# EAGLE design usb2 (EAGLE 9.0.1)
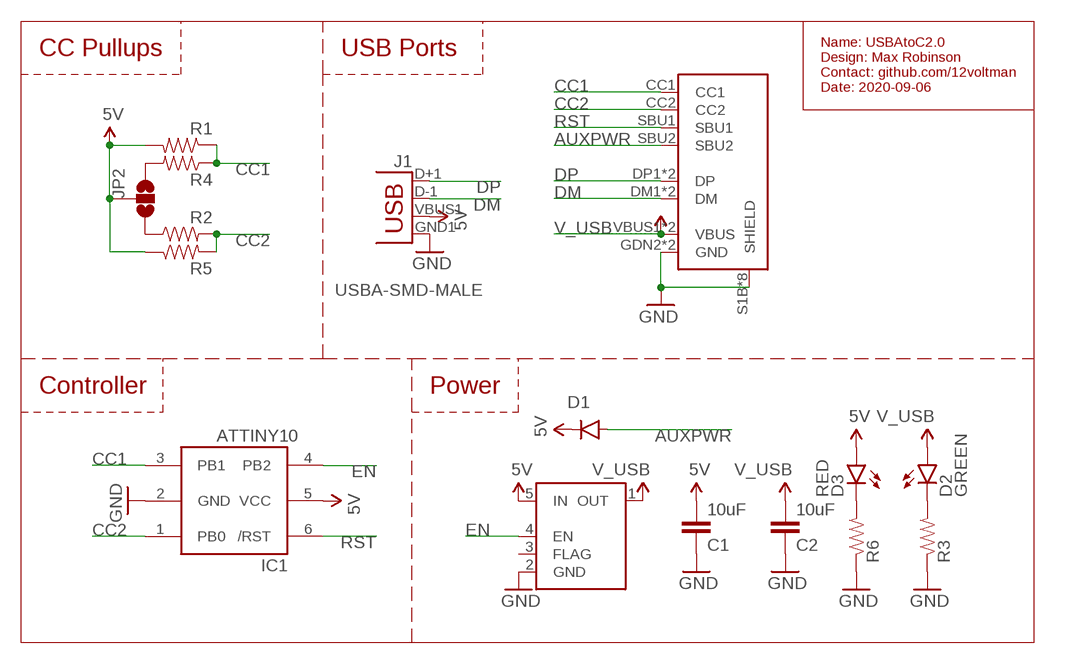
[diagram p0: schematic, sheet 1]

## Parts
C1  10uF  10UF-6.3V-20%(0603)  [0603-CAP]
C2  10uF  10UF-6.3V-20%(0603)  [0603-CAP]
D1  250mA/100V  DIODEBAS16  [SOD-323]
D2  GREEN  LED-GREEN0603  [LED-0603]
D3  RED  LED-RED0603  [LED-0603]
IC1  ATTINY10  [SOT23-6]
J1  USBA-SMD-MALE  [USB-A-SMT-MALE]
JP2  JUMPER-PAD-3-NOYES_SILK  [PAD-JUMPER-3-NO_YES_SILK]
R1  RESISTOR0603  [0603-RES]
R2  RESISTOR0603  [0603-RES]
R3  RESISTOR0603  [0603-RES]
R4  RESISTOR0603  [0603-RES]
R5  RESISTOR0603  [0603-RES]
R6  RESISTOR0603  [0603-RES]
U$1  USB-C_USB2ONLY-OUTLINE  [USB-C_12PIN_HORZ-F-OUTLINE]
U$2  AP22804/14*W5-7  [SOT23-5]

## Nets
5V: C1.2 D1.C D3.A IC1.5(VCC) J1.VBUS1(VBUS) JP2.2 R1.2 R5.1 U$2.5(IN)
AUXPWR: D1.A U$1.SBU2
CC1: IC1.3(PB1) R1.1 R4.1 U$1.CC1
CC2: IC1.1(PB0) R2.2 R5.2 U$1.CC2
DM: J1.D-1(D-) U$1.DM1(DM) U$1.DM2(DM)
DP: J1.D+1(D+) U$1.DP1(DP) U$1.DP2(DP)
EN: IC1.4(PB2) U$2.4(EN)
GND: C1.1 C2.1 IC1.2(GND) J1.GND1(GND) R3.1 R6.1 U$1.GDN2(GND) U$1.GND1(GND) U$1.S1B(SHIELD) U$1.S1T(SHIELD) U$1.S2B(SHIELD) U$1.S2T(SHIELD) U$1.S3B(SHIELD) U$1.S3T(SHIELD) U$1.S4B(SHIELD) U$1.S4T(SHIELD) U$2.2(GND)
N$1: D2.C R3.2
N$2: JP2.3 R2.1
N$3: JP2.1 R4.2
N$4: D3.C R6.2
RST: IC1.6(/RST) U$1.SBU1
V_USB: C2.2 D2.A U$1.VBUS1(VBUS) U$1.VBUS2(VBUS) U$2.1(OUT)
Unconnected: U$2.3(FLAG)

## Notes on the sheet
- CC Pullups | USB Ports
- Name: USBAtoC2.0
  Design: Max Robinson
  Contact: github.com/12voltman
  Date: 2020-09-06
- Controller | Power

## Library data of the parts
C1 C2 = SparkFun-Capacitors:10UF-6.3V-20%(0603): CAP-11015; PROD_ID: CAP-11015
D1 = SparkFun-DiscreteSemi:DIODE: Diode These are standard reverse protection diodes and small signal diodes. SMA package can handle up to about 1A. SOD-323 can handle about 200mA. What the SOD-323 package when ordering, there are some mfgs out there that are 5-pin packages.; PROD_ID: DIO-09646
D2 = SparkFun-LED:LED-GREEN: Various green LEDs Green LEDs used in SFE Production 0603- DIO-00821 LARGE- DIO-00862 LILYPAD- DIO-09910; PROD_ID: DIO-00821
D3 = SparkFun-LED:LED-RED: Assorted Red LEDs LilyPad 1206- DIO-09912 1206- DIO-00809 0603- DIO-00819 "SMART" means more efficient and expensive; PROD_ID: DIO-00819
IC1 = adafruit:ATTINY10: ATtiny4/5/9/10 8-bit Microcontroller with 512/1024 Bytes In-System Programmable Flash
J1 = SparkFun-Connectors:USB: USB Connectors USB-B-PTH is fully proven SKU : PRT-00139/CONN-08278 USB-miniB is fully proven SKU : PRT-00587 USB-A-PCB is untested. USB-A-H is throughly reviewed, but untested. Spark Fun Electronics SKU : PRT-00437 USB-B-SMT is throughly reviewed, but untested. Needs silkscreen touching up. USB-A-S has not been used/tested USB-MB-H has not been used/tested USB-MICROB has been used. CONN-09505
JP2 = SparkFun-Passives:JUMPER-PAD-3-NO
R1-R6 = SparkFun-Resistors:RESISTOR: Resistor Basic schematic elements and footprints for 0603, 1206, and PTH resistors.
U$1 = 12voltman:USB-C_USB2ONLY
U$2 = 12voltman:AP22804/14: AP22804 / AP22814 Single-channel load switch with current limiting. Ideal for USB host power control. Tech specs: Current Limit: 2.5A (AP22804), 3.0A (AP22814) Enable Pin Polarity: Active High ("A" variant), Active Low ("B" variant) ESD Protection: 2kV HBM, 200V MM On-resistance: 50mOhm Voltage Range: 2.7V - 5.5V Soft Start: 6ms rise time (typ) Overcurrent / Overtemperature Alert Pin Reverse Current/Power Protection Datasheet <https://www.diodes.com/assets/Datasheets/AP22804_14.pdf>

## Board
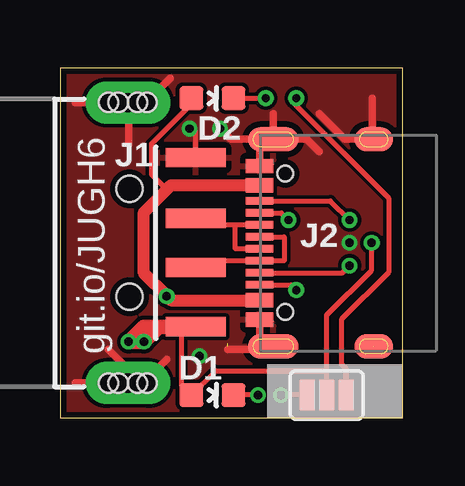
[diagram p1: board, top side]
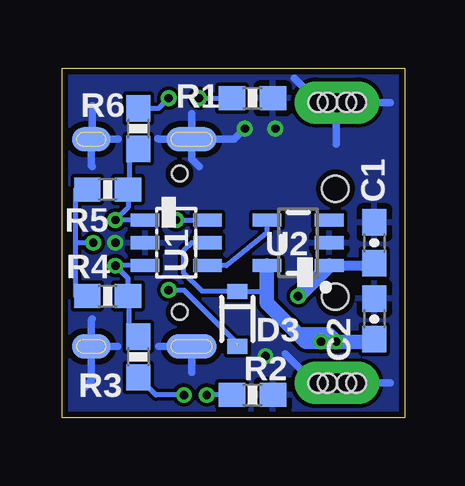
[diagram p2: board, bottom side, seen from below]

Size 14.28 x 14.6 mm. Coordinates in mm from the lower left corner, seen from the top.
Outline: 0,0 14.28,0 14.28,14.6 0,14.6 0,0
Copper layers (1*16): Top 0.035mm / dielectric 1.5mm / Bottom 0.035mm
Design rules "SeeedStudio_2layer_DRU": minimum track width 6mil, minimum drill 12mil, track to track 6mil, track to pad 6mil, pad to pad 6mil, via to via 6mil, smd to smd 0mil, copper to edge 10mil, drill to drill 10mil, minimum pad ring 10mil, minimum via ring 6mil, stop-mask expansion 2mil, vias tented up to drill 100mil, thermal gap 10mil

### Footprints (pad centres in the part's own frame; a part is rotated, then mirrored left to right if it is on the bottom)
0603-CAP = smd 1.1 x 1: 1 -0.85,0; 2 0.85,0
SOD-323 = smd 0.63 x 0.83: A 1.15,0; C -1.15,0
LED-0603 = smd 1 x 1: A 0,-0.877; C 0,0.877
SOT23-6 = smd 0.55 x 1.2: 1 -0.95,-1.3; 2 0,-1.3; 3 0.95,-1.3; 4 0.95,1.3; 5 0,1.3; 6 -0.95,1.3
USB-A-SMT-MALE = smd 0.8 x 2.5: D+1 1.027,-5.87; D-1 -1.027,-5.87; GND1 3.551,-5.87; VBUS1 -3.5,-5.87 | drill 0.8 pad 1.778 long: P$1 5.85,-3.05; P$3 -5.85,-3.05 | hole 1.1: 2.25,-3.12; -2.25,-3.12 | hole 0.8: -5.85,-3.45; -5.85,-3.85; -5.85,-2.65; -5.85,-2.25; 5.85,-3.45; 5.85,-3.85; 5.85,-2.65; 5.85,-2.25
PAD-JUMPER-3-NO_YES_SILK = smd 0.635 x 1.27: 1 -0.813,0; 2 0,0; 3 0.813,0
0603-RES = smd 1.1 x 1: 1 -0.85,0; 2 0.85,0
USB-C_12PIN_HORZ-F-OUTLINE = smd 0.3 x 1.15: CC1 1.25,-0.575; CC2 -1.75,-0.575; DM1 -0.25,-0.575; DM2 0.75,-0.575; DP1 0.25,-0.575; DP2 -0.75,-0.575; SBU1 -1.25,-0.575; SBU2 1.75,-0.575 | smd 0.6 x 1.15: GDN2 3.2,-0.575; GND1 -3.2,-0.575; VBUS1 -2.4,-0.575; VBUS2 2.4,-0.575 | smd 1 x 2.1 bottom: S1B -4.32,0; S4B 4.32,0 | smd 1 x 2.1: S1T -4.32,0; S4T 4.32,0 | smd 1 x 1.6 bottom: S2B -4.32,4.18; S3B 4.32,4.18 | smd 1 x 1.6: S2T -4.32,4.18; S3T 4.32,4.18 | hole 0.65: -2.89,0.5; 2.89,0.5
SOT23-5 = smd 0.55 x 1.2: 1 -0.95,-1.3; 2 0,-1.3; 3 0.95,-1.3; 4 0.95,1.3; 5 -0.95,1.3

### Placement (x,y rotation side)
C1  1.27,4.13 270 bottom
C2  1.27,7.3 270 bottom
D1  6.99,4.13 270 bottom
D2  6.35,13.34 270 top
D3  6.35,0.95 270 top
IC1  9.53,7.3 270 bottom
J1  -0.22,7.3 90 top
JP2  11.11,0.95 0 top
R1  12.38,5.08 180 bottom
R2  11.11,12.06 270 bottom
R3  6.35,13.34 180 bottom
R4  11.11,2.54 270 bottom
R5  12.38,9.53 0 bottom
R6  6.35,0.95 180 bottom
U$1  8.89,7.3 270 top
U$2  4.45,7.3 90 bottom

### Tracks (layer width: path | path; a pad name or v marks a point on that pad's centre or on a via)
5V  (via drill 0.35)
  Top 0.203: J1.VBUS1 5.47,3.63 | JP2.2 11.11,1.97 | 11.11,1.97 11.11,4.29 12.99,6.16 v12.99,7.3 | 5.08,3.8 5.08,1.34 D3.A 6.49,1.97 11.11,1.97
  Top 0.61: 4.12,3.8 5.08,3.8 J1.VBUS1 | 4.12,3.8 v3.49,3.17 v2.86,3.17 3.48,3.8 4.12,3.8
  Bottom 0.203: 4.25,3.17 4.13,3.17 | IC1.5 8.89,7.3 9.21,6.99 9.21,6.03 8.45,5.28 D1.C 5.87,5.28 5.75,5.4 | R1.2 13.72,5.08 13.72,7.3 | R5.1 13.72,9.53 13.72,7.3 | v12.99,7.3 13.72,7.3
  Bottom 0.61: v2.86,3.17 v3.49,3.17 4.13,3.17 4.45,3.49 | C1.2 1.37,3.17 v2.86,3.17 | U$2.5 5.75,5.4 5.75,4.79 4.45,3.49 | v2.86,3.17 3.17,3.49 4.45,3.49
AUXPWR  (via drill 0.35)  (1 unrouted)
  Top 0.203: U$1.SBU2 9.62,5.55 v9.84,5.33
  Bottom 0.203: v9.84,5.33 9.21,5.33 6.99,3.11
CC1  (via drill 0.35)
  Top 0.203: U$1.CC1 11.77,6.05 v12.06,6.35
  Bottom 0.203: 11.48,5.13 R1.1 11.53,5.82 v12.06,6.35 IC1.3 | R4.1 11.48,3.76 11.48,5.13 | 11.48,5.4 11.48,5.13
CC2  (via drill 0.35)
  Top 0.203: U$1.CC2 11.27,9.05 v12.06,8.26
  Bottom 0.203: R5.2 11.48,9.47 11.48,10.85 R2.2 | 11.53,9.21 R5.2 | IC1.1 v12.06,8.25 | v12.06,8.25 v12.06,8.26 | R5.2 11.53,8.78 v12.06,8.25
DM
  Top 0.203: J1.D-1 5.92,6.55 U$1.DM2 9.34,6.55 9.34,7.55 U$1.DM1
DP
  Top 0.203: U$1.DP2 7.3,8.05 | 7.3,8.05 5.92,8.05 J1.D+1 | U$1.DP1 7.3,7.05 7.3,8.05
EN
  Bottom 0.203: U$2.4 5.75,7.72 7.43,6.35 IC1.4
GND  (via drill 0.35)  (2 unrouted)
  Top 0.203: J1.GND1 5.65,12 v5.4,12.06
  Top 0.305: U$1.S4T 8.77,2.86 8.26,2.86 | 8.26,2.86 6.99,2.86 | U$1.GDN2 8.31,2.92 8.26,2.86 | 10.79,12.7 11.87,11.62 U$1.S2T 13.02,11.68 13.02,13.34 | U$1.S1T 10.29,11.62 10.79,11.11 | U$1.S1T 8.26,11.62 | 8.26,11.62 7.11,11.62 v6.67,12.06 | U$1.S1T 8.89,12.7 | U$1.GND1 8.31,11.56 8.26,11.62 | 2.89,13.14 2.86,13.14 | 2.86,13.14 0.64,13.14 | 2.86,13.14 2.86,11.43 | 2.89,1.46 0.64,1.46 | 4.45,2.44 3.37,1.36 | 4.6,14.16 3.62,13.18 | 2,2.86 3.4,1.46
  Bottom 0.305: U$1.S1T 7.11,11.62 v6.67,12.06 | U$1.S1T 8.89,10.79 8.57,10.48 | U$1.S1T 8.89,12.7 | U$1.S1T 10.26,11.62 10.29,11.65 | U$1.S2T 11.94,11.62 | U$1.S2T 13.07,10.53 13.02,10.48 | U$1.S2T 13.02,11.68 13.02,13.02 | U$1.S3T 13.07,4.08 13.02,4.13 | U$1.S3T 13.07,1.53 13.34,1.27 | U$1.S3T 11.97,2.98 | 10.26,2.98 10.25,2.98 U$1.S4T 8.89,1.91 | 0.6,1.46 2.86,1.46 | 3.59,1.27 4.99,2.67 | 0.6,13.14 2.86,13.14 2.86,11.43 | 3.62,13.18 4.6,14.16
  other vias: 12.06,7.3 5.81,2.57
  pour Top: -0.64,14.92 14.61,14.92 14.61,-0.32 -0.64,-0.32
  pour Bottom: 14.61,14.92 -0.64,14.92 -0.64,-0.32 14.61,-0.32
N$1  (via drill 0.35)
  Top 0.203: D2.C v8.57,13.34
  Bottom 0.203: v8.57,13.34 R3.2
N$2  (via drill 0.35)
  Top 0.203: v9.84,13.34 9.84,13.02 13.72,9.14 13.72,6.1 11.75,4.13 11.75,2.22 11.93,2.04 JP2.3
  Bottom 0.203: R2.1 10.26,12.91 v9.84,13.34
N$3  (via drill 0.35)
  Top 0.203: JP2.1 v9.21,0.95
  Bottom 0.203: v9.21,0.95 10.38,0.95 R4.2
N$4  (via drill 0.35)
  Top 0.203: v8.26,0.95 D3.C
  Bottom 0.203: R6.2 v8.26,0.95
RST  (via drill 0.35)
  Top 0.203: U$1.SBU1 9.23,8.55 v9.53,8.26
  Bottom 0.203: v9.53,8.26 v9.52,8.25 IC1.6
V_USB  (via drill 0.35)
  Top 0.203: D2.A 5.47,13.09 3.81,11.43 3.81,10.16 4.45,9.53
  Top 0.508: U$1.VBUS2 4.62,4.9 v4.45,5.08 3.49,6.03 3.49,8.57 4.45,9.53 4.62,9.7 U$1.VBUS1
  Bottom 0.406: U$2.1 1.37,6.35 C2.2
  Bottom 0.61: U$2.1 4.42,5.08 v4.45,5.08

### Text on the board
tPlace: D2 | J1 | J2 | git.io/JUGH6 | D1
bPlace: R1 | R6 | C1 | R5 | U2 | U1 | R4 | D3 | C2 | R2 | R3